# Altium schematic sheet VCU_1_2.SchDoc: VCU_1.3
size A3; Author: GAOYANG; Organization: Altium Limited; Address1: L3, 12a Rodborough Rd; Address2: Frenchs Forest; Address3: NSW; Address4: Australia 2086; Revision: 1.3
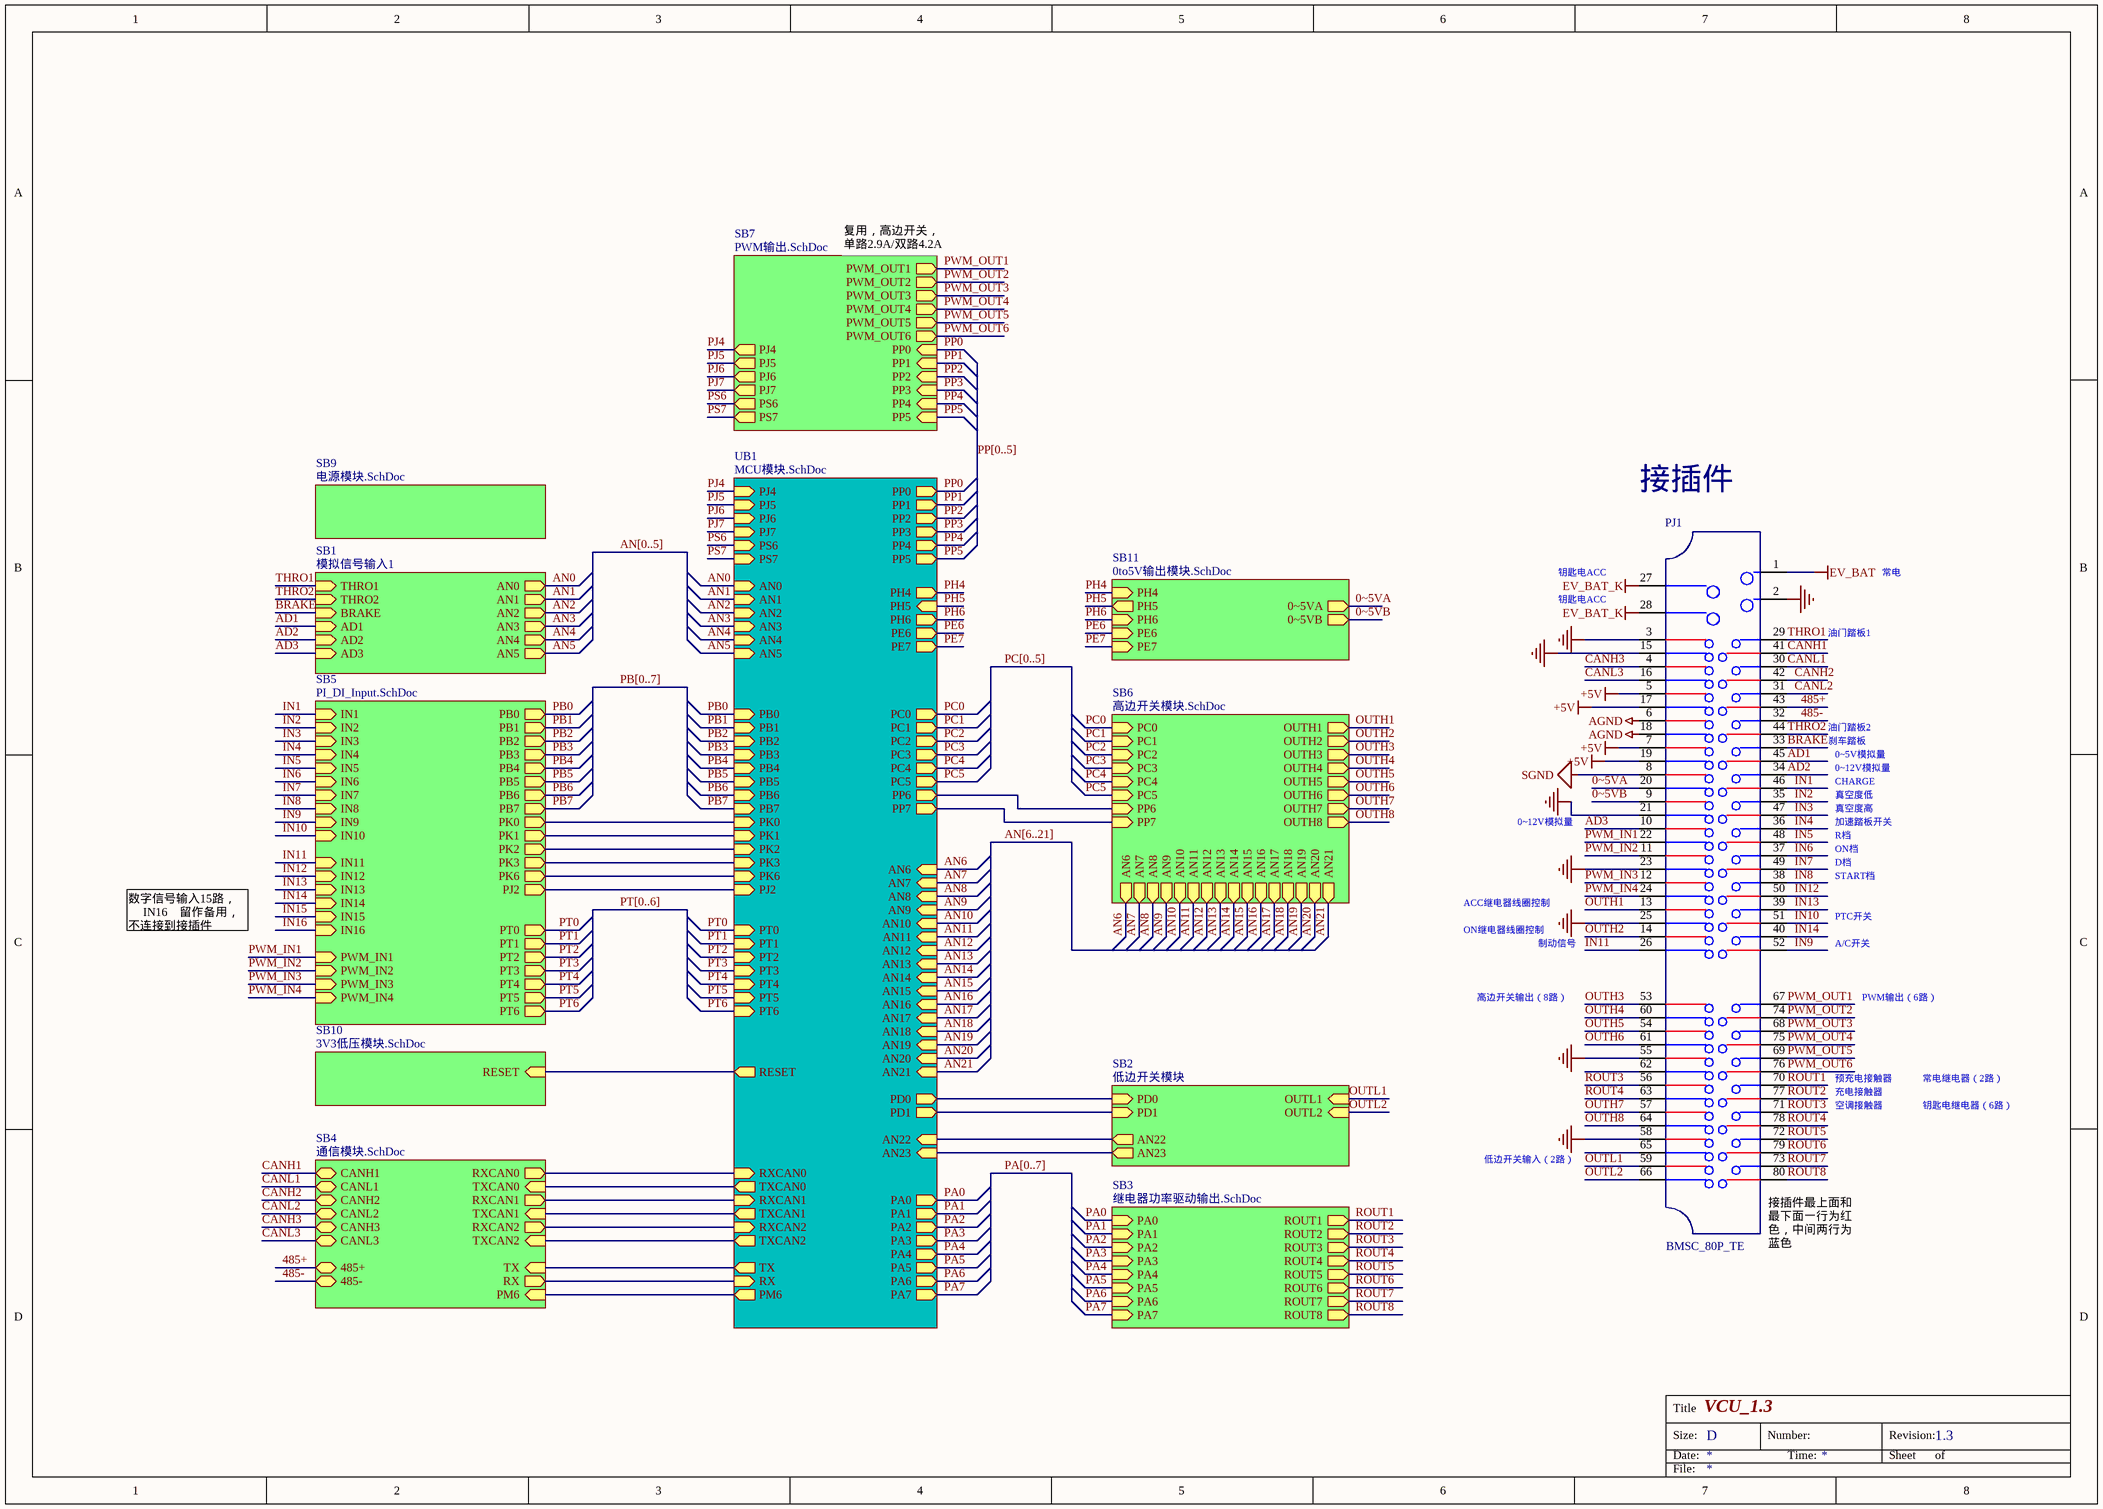
[diagram p0: VCU_1_2.SchDoc]

## Parts
PJ1  BMSC_80P_TE  [BMSC_80P]

## Sub-sheets
SB1 = 模拟信号输入1: THRO1 (in), THRO2 (in), BRAKE (in), AD1 (in), AD2 (in), AD3 (in), AN0 (out), AN1 (out), AN2 (out), AN3 (out), AN4 (out), AN5 (out)
SB2 = 低边开关模块: PD0 (in), PD1 (in), OUTL1 (in), OUTL2 (in), AN22 (out), AN23 (out)
SB3 = 继电器功率驱动输出.SchDoc: ROUT1 (out), ROUT2 (out), ROUT3 (out), ROUT4 (out), ROUT5 (out), ROUT6 (out), ROUT7 (out), ROUT8 (out), PA0 (in), PA1 (in), PA2 (in), PA3 (in), PA4 (in), PA5 (in), PA6 (in), PA7 (in)
SB4 = 通信模块.SchDoc: CANH1 (bidir), CANL1 (bidir), CANL2 (bidir), CANL3 (bidir), CANH2 (bidir), CANH3 (bidir), TXCAN0 (in), RXCAN0 (out), TXCAN1 (in), RXCAN1 (out), RXCAN2 (out), TXCAN2 (in), TX (in), RX (out), PM6 (in), 485+ (bidir), 485- (bidir)
SB5 = PI_DI_Input.SchDoc: IN1 (in), IN2 (in), IN3 (in), IN4 (in), IN5 (in), IN6 (in), IN7 (in), IN8 (in), IN9 (in), IN10 (in), IN11 (in), IN12 (in), IN13 (in), IN14 (in), PWM_IN1 (in), PWM_IN2 (in), PWM_IN3 (in), PWM_IN4 (in), PT0 (out), PT1 (out), PT2 (out), PT3 (out), PT4 (out), PT5 (out), PT6 (out), PB0 (out), PB1 (out), PB2 (out), PB3 (out), PB4 (out), PB5 (out), PB6 (out), PB7 (out), PK0 (out), PK1 (out), PK2 (out), PK3 (out), PK6 (out), PJ2 (out), IN15 (in), IN16 (in)
SB6 = 高边开关模块.SchDoc: OUTH1 (out), OUTH2 (out), OUTH3 (out), OUTH4 (out), OUTH5 (out), OUTH6 (out), PC0 (in), PC1 (in), PC2 (in), PC3 (in), PC4 (in), PC5 (in), AN6 (out), AN7 (out), AN8 (out), AN9 (out), AN10 (out), AN11 (out), AN12 (out), AN13 (out), AN14 (out), AN15 (out), AN16 (out), AN17 (out), AN18 (out), AN19 (out), PP6 (in), PP7 (in), OUTH7 (out), OUTH8 (out), AN20 (out), AN21 (out)
SB7 = PWM输出.SchDoc: PWM_OUT1 (out), PWM_OUT2 (out), PWM_OUT3 (out), PWM_OUT4 (out), PWM_OUT5 (out), PWM_OUT6 (out), PP0 (in), PP1 (in), PP2 (in), PP3 (in), PP4 (in), PP5 (in), PJ4 (out), PJ5 (out), PJ6 (out), PJ7 (out), PS6 (out), PS7 (out)
SB9 = 电源模块.SchDoc: no entries
SB10 = 3V3低压模块.SchDoc: RESET (in)
SB11 = 0to5V输出模块.SchDoc: PH4 (in), PH5 (out), PH6 (in), PE6 (in), 0~5VA (out), 0~5VB (out), PE7 (in)
UB1 = MCU模块.SchDoc: PP0 (out), PP1 (out), PP2 (out), PP3 (out), PP4 (out), PP5 (out), PJ2 (in), PK6 (in), PK0 (in), PK1 (in), PK2 (in), PK3 (in), PT0 (in), PT1 (in), PT2 (in), PT3 (in), PT4 (in), PT5 (in), PT6 (in), PC0 (out), PC1 (out), PC2 (out), PB0 (in), PB1 (in), PB2 (in), PB3 (in), PB4 (in), PB5 (in), PB6 (in), PB7 (in), PC3 (out), PC4 (out), PC5 (out), PD0 (out), PD1 (out), PA0 (out), PA1 (out), PA2 (out), PA3 (out), PA4 (out), PA5 (out), PA6 (out), PA7 (out), AN0 (in), AN1 (in), AN2 (in), AN3 (in), AN4 (in), AN5 (in), RESET (out), AN22 (in), AN23 (in), PJ4 (in), PJ5 (in), PJ6 (in), PJ7 (in), PS6 (in), PS7 (in), RXCAN0 (in), RXCAN1 (in), RXCAN2 (in), TXCAN0 (out), TXCAN1 (out), TXCAN2 (out), TX (out), PM6 (out), RX (in), AN6 (in), AN7 (in), AN8 (in), AN9 (in), AN10 (in), AN11 (in), AN12 (in), AN13 (in), AN14 (in), AN15 (in), AN16 (in), AN17 (in), PH4 (out), PH5 (in), PH6 (out), PE6 (out), PE7 (out), AN18 (in), AN19 (in), PP6 (out), PP7 (out), AN20 (in), AN21 (in)

## Nets
+5V: PJ1.5 PJ1.7 PJ1.17 PJ1.19
AGND: PJ1.6 PJ1.18
EV_BAT: PJ1.1
EV_BAT_K: PJ1.27 PJ1.28
GND: PJ1.2 PJ1.3 PJ1.15 PJ1.21 PJ1.23 PJ1.25 PJ1.55 PJ1.58
SGND: PJ1.8
0~5VA: PJ1.20 ; sheet SB11/0~5VA
0~5VB: PJ1.9 ; sheet SB11/0~5VB
485+: PJ1.43 ; sheet SB4/485+
485-: PJ1.32 ; sheet SB4/485-
AD1: PJ1.45 ; sheet SB1/AD1
AD2: PJ1.34 ; sheet SB1/AD2
AD3: PJ1.10 ; sheet SB1/AD3
AN0: sheet UB1/AN0, sheet SB1/AN0
AN1: sheet UB1/AN1, sheet SB1/AN1
AN2: sheet UB1/AN2, sheet SB1/AN2
AN3: sheet UB1/AN3, sheet SB1/AN3
AN4: sheet UB1/AN4, sheet SB1/AN4
AN5: sheet UB1/AN5, sheet SB1/AN5
AN6: sheet UB1/AN6, sheet SB6/AN6
AN7: sheet UB1/AN7, sheet SB6/AN7
AN8: sheet UB1/AN8, sheet SB6/AN8
AN9: sheet UB1/AN9, sheet SB6/AN9
AN10: sheet UB1/AN10, sheet SB6/AN10
AN11: sheet UB1/AN11, sheet SB6/AN11
AN12: sheet UB1/AN12, sheet SB6/AN12
AN13: sheet UB1/AN13, sheet SB6/AN13
AN14: sheet UB1/AN14, sheet SB6/AN14
AN15: sheet UB1/AN15, sheet SB6/AN15
AN16: sheet UB1/AN16, sheet SB6/AN16
AN17: sheet UB1/AN17, sheet SB6/AN17
AN18: sheet UB1/AN18, sheet SB6/AN18
AN19: sheet UB1/AN19, sheet SB6/AN19
AN20: sheet UB1/AN20, sheet SB6/AN20
AN21: sheet UB1/AN21, sheet SB6/AN21
BRAKE: PJ1.33 ; sheet SB1/BRAKE
CANH1: PJ1.41 ; sheet SB4/CANH1
CANH2: PJ1.42 ; sheet SB4/CANH2
CANH3: PJ1.4 ; sheet SB4/CANH3
CANL1: PJ1.30 ; sheet SB4/CANL1
CANL2: PJ1.31 ; sheet SB4/CANL2
CANL3: PJ1.16 ; sheet SB4/CANL3
IN1: PJ1.46 ; sheet SB5/IN1
IN2: PJ1.35 ; sheet SB5/IN2
IN3: PJ1.47 ; sheet SB5/IN3
IN4: PJ1.36 ; sheet SB5/IN4
IN5: PJ1.48 ; sheet SB5/IN5
IN6: PJ1.37 ; sheet SB5/IN6
IN7: PJ1.49 ; sheet SB5/IN7
IN8: PJ1.38 ; sheet SB5/IN8
IN9: PJ1.52 ; sheet SB5/IN9
IN10: PJ1.51 ; sheet SB5/IN10
IN11: PJ1.26 ; sheet SB5/IN11
IN12: PJ1.50 ; sheet SB5/IN12
IN13: PJ1.39 ; sheet SB5/IN13
IN14: PJ1.40 ; sheet SB5/IN14
IN15: sheet SB5/IN15
IN16: sheet SB5/IN16
OUTH1: PJ1.13 ; sheet SB6/OUTH1
OUTH2: PJ1.14 ; sheet SB6/OUTH2
OUTH3: PJ1.53 ; sheet SB6/OUTH3
OUTH4: PJ1.60 ; sheet SB6/OUTH4
OUTH5: PJ1.54 ; sheet SB6/OUTH5
OUTH6: PJ1.61 ; sheet SB6/OUTH6
OUTH7: PJ1.57 ; sheet SB6/OUTH7
OUTH8: PJ1.64 ; sheet SB6/OUTH8
OUTL1: PJ1.59 ; sheet SB2/OUTL1
OUTL2: PJ1.66 ; sheet SB2/OUTL2
PA0: sheet SB3/PA0, sheet UB1/PA0
PA1: sheet SB3/PA1, sheet UB1/PA1
PA2: sheet SB3/PA2, sheet UB1/PA2
PA3: sheet SB3/PA3, sheet UB1/PA3
PA4: sheet SB3/PA4, sheet UB1/PA4
PA5: sheet SB3/PA5, sheet UB1/PA5
PA6: sheet SB3/PA6, sheet UB1/PA6
PA7: sheet SB3/PA7, sheet UB1/PA7
PB0: sheet UB1/PB0, sheet SB5/PB0
PB1: sheet UB1/PB1, sheet SB5/PB1
PB2: sheet UB1/PB2, sheet SB5/PB2
PB3: sheet UB1/PB3, sheet SB5/PB3
PB4: sheet UB1/PB4, sheet SB5/PB4
PB5: sheet UB1/PB5, sheet SB5/PB5
PB6: sheet UB1/PB6, sheet SB5/PB6
PB7: sheet UB1/PB7, sheet SB5/PB7
PC0: sheet UB1/PC0, sheet SB6/PC0
PC1: sheet UB1/PC1, sheet SB6/PC1
PC2: sheet UB1/PC2, sheet SB6/PC2
PC3: sheet UB1/PC3, sheet SB6/PC3
PC4: sheet UB1/PC4, sheet SB6/PC4
PC5: sheet UB1/PC5, sheet SB6/PC5
PE6: sheet UB1/PE6, sheet SB11/PE6
PE7: sheet UB1/PE7, sheet SB11/PE7
PH4: sheet UB1/PH4, sheet SB11/PH4
PH5: sheet UB1/PH5, sheet SB11/PH5
PH6: sheet UB1/PH6, sheet SB11/PH6
PJ4: sheet UB1/PJ4, sheet SB7/PJ4
PJ5: sheet UB1/PJ5, sheet SB7/PJ5
PJ6: sheet UB1/PJ6, sheet SB7/PJ6
PJ7: sheet UB1/PJ7, sheet SB7/PJ7
PP0: sheet UB1/PP0, sheet SB7/PP0
PP1: sheet UB1/PP1, sheet SB7/PP1
PP2: sheet UB1/PP2, sheet SB7/PP2
PP3: sheet UB1/PP3, sheet SB7/PP3
PP4: sheet UB1/PP4, sheet SB7/PP4
PP5: sheet UB1/PP5, sheet SB7/PP5
PS6: sheet UB1/PS6, sheet SB7/PS6
PS7: sheet UB1/PS7, sheet SB7/PS7
PT0: sheet UB1/PT0, sheet SB5/PT0
PT1: sheet UB1/PT1, sheet SB5/PT1
PT2: sheet UB1/PT2, sheet SB5/PT2
PT3: sheet UB1/PT3, sheet SB5/PT3
PT4: sheet UB1/PT4, sheet SB5/PT4
PT5: sheet UB1/PT5, sheet SB5/PT5
PT6: sheet UB1/PT6, sheet SB5/PT6
PWM_IN1: PJ1.22 ; sheet SB5/PWM_IN1
PWM_IN2: PJ1.11 ; sheet SB5/PWM_IN2
PWM_IN3: PJ1.12 ; sheet SB5/PWM_IN3
PWM_IN4: PJ1.24 ; sheet SB5/PWM_IN4
PWM_OUT1: PJ1.67 ; sheet SB7/PWM_OUT1
PWM_OUT2: PJ1.74 ; sheet SB7/PWM_OUT2
PWM_OUT3: PJ1.68 ; sheet SB7/PWM_OUT3
PWM_OUT4: PJ1.75 ; sheet SB7/PWM_OUT4
PWM_OUT5: PJ1.69 ; sheet SB7/PWM_OUT5
PWM_OUT6: PJ1.76 ; sheet SB7/PWM_OUT6
ROUT1: PJ1.70 ; sheet SB3/ROUT1
ROUT2: PJ1.77 ; sheet SB3/ROUT2
ROUT3: PJ1.56 PJ1.71 ; sheet SB3/ROUT3
ROUT4: PJ1.63 PJ1.78 ; sheet SB3/ROUT4
ROUT5: PJ1.72 ; sheet SB3/ROUT5
ROUT6: PJ1.79 ; sheet SB3/ROUT6
ROUT7: PJ1.73 ; sheet SB3/ROUT7
ROUT8: PJ1.80 ; sheet SB3/ROUT8
THRO1: PJ1.29 ; sheet SB1/THRO1
THRO2: PJ1.44 ; sheet SB1/THRO2
(unnamed): sheet SB4/TXCAN0, sheet UB1/TXCAN0
(unnamed): sheet SB4/RXCAN0, sheet UB1/RXCAN0
(unnamed): sheet SB4/TXCAN1, sheet UB1/TXCAN1
(unnamed): sheet SB4/RXCAN1, sheet UB1/RXCAN1
(unnamed): sheet SB4/RXCAN2, sheet UB1/RXCAN2
(unnamed): sheet SB4/TXCAN2, sheet UB1/TXCAN2
(unnamed): sheet SB4/TX, sheet UB1/TX
(unnamed): sheet SB4/RX, sheet UB1/RX
(unnamed): sheet SB4/PM6, sheet UB1/PM6
(unnamed): sheet UB1/PJ2, sheet SB5/PJ2
(unnamed): sheet UB1/PK6, sheet SB5/PK6
(unnamed): sheet UB1/PK0, sheet SB5/PK0
(unnamed): sheet UB1/PK1, sheet SB5/PK1
(unnamed): sheet UB1/PK2, sheet SB5/PK2
(unnamed): sheet UB1/PK3, sheet SB5/PK3
(unnamed): sheet UB1/PD0, sheet SB2/PD0
(unnamed): sheet UB1/PD1, sheet SB2/PD1
(unnamed): sheet UB1/RESET, sheet SB10/RESET
(unnamed): sheet UB1/AN22, sheet SB2/AN22
(unnamed): sheet UB1/AN23, sheet SB2/AN23
(unnamed): sheet UB1/PP6, sheet SB6/PP6
(unnamed): sheet UB1/PP7, sheet SB6/PP7

Not connected (* = marked no-connect by the designer): PJ1 62(113) 65(116)

## Buses and harness runs
bus AN[0..5]
bus AN[6..21]
bus PA[0..7]
bus PB[0..7]
bus PC[0..5]
bus PP[0..5]
bus PT[0..6]

## Notes on the sheet
- 复用，高边开关，单路2.9A/双路4.2A
- 接插件
- 钥匙电ACC
- 常电
- 油门踏板1
- 油门踏板2
- 刹车踏板
- 0~5V模拟量
- 0~12V模拟量
- CHARGE
- 加速踏板开关
- R档
- ON档
- 真空度低
- 真空度高
- ACC继电器线圈控制
- D档
- START档
- PTC开关
- 数字信号输入15路，
  IN16    留作备用，
  不连接到接插件
- ON继电器线圈控制
- 制动信号
- A/C开关
- 高边开关输出（8路）
- PWM输出（6路）
- 空调接触器
- 预充电接触器
- 充电接触器
- 常电继电器（2路）
- 钥匙电继电器（6路）
- 低边开关输入（2路）
- (near PJ1) 接插件最上面和最下面一行为红色，中间两行为蓝色
- Title
- Size:
- Date:
- D
- Number:
- Time:
- Revision:
- Sheet
- of
- File:

## Library data of the parts
PJ1 = BMSC_80P